# EAGLE design attiny2312 (EAGLE 6.4)
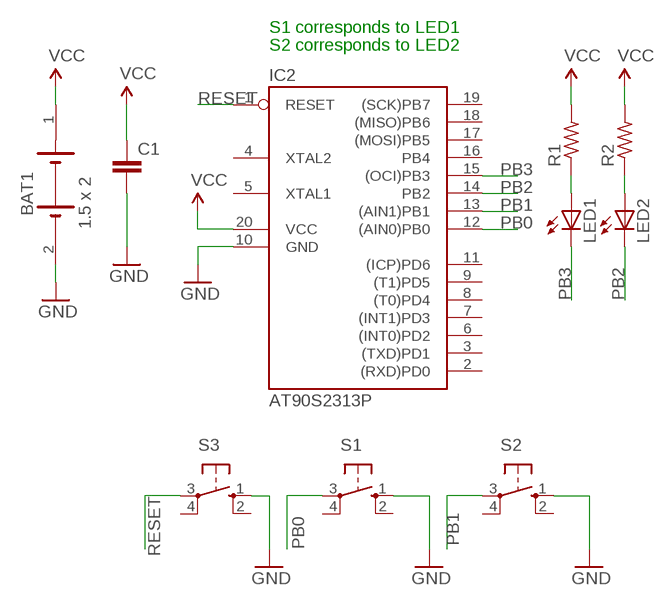
[diagram p0: schematic, sheet 1]

## Parts
BAT1  1.5 x 2  1.5X2BATTERYRELIMATE  [RELIMATE]
C1  C2.5/2  [C2.5-2]
IC2  AT90S2313P  [DIL20]
LED1  LED3MM  [LED3MM]
LED2  LED3MM  [LED3MM]
R1  R-US_0207/10  [0207/10]
R2  R-US_0207/10  [0207/10]
S1  10-XX  [B3F-10XX]
S2  10-XX  [B3F-10XX]
S3  10-XX  [B3F-10XX]

## Nets
GND: BAT1.2 C1.2 IC2.10(GND) S1.1(S) S2.1(S) S3.1(S)
N$3: LED1.A R1.1
N$4: LED2.A R2.1
PB0: IC2.12((AIN0)PB0) S1.3(P)
PB1: IC2.13((AIN1)PB1) S2.3(P)
PB2: IC2.14(PB2) LED2.K(C)
PB3: IC2.15((OCI)PB3) LED1.K(C)
RESET: IC2.1(RESET) S3.3(P)
VCC: BAT1.1 C1.1 IC2.20(VCC) R1.2 R2.2
Unconnected: IC2.2((RXD)PD0) IC2.3((TXD)PD1) IC2.4(XTAL2) IC2.5(XTAL1) IC2.6((INT0)PD2) IC2.7((INT1)PD3) IC2.8((T0)PD4) IC2.9((T1)PD5) IC2.11((ICP)PD6) IC2.16(PB4) IC2.17((MOSI)PB5) IC2.18((MISO)PB6) IC2.19((SCK)PB7) S1.2(S1) S1.4(P1) S2.2(S1) S2.4(P1) S3.2(S1) S3.4(P1)

## Notes on the sheet
- S1 corresponds to LED1
- S2 corresponds to LED2

## Library data of the parts
BAT1 = nehul:1.5X2BATTERY
C1 = capacitor-wima:C: CAPACITOR naming: grid - package width
IC2 = atmel:AT90S2313: MICROCONTROLLER 2 Kbytes FLASH 128 bytes SRAM 128 bytes EEPROM UART; OC_FARNELL: unknown; OC_NEWARK: unknown
LED1 LED2 = SparkFun:LED: LEDs Standard schematic elements and footprints for 5mm, 3mm, 1206, and 0603 sized LEDs. 5mm - Spark Fun Electronics SKU : COM-00529 (and others)
R1 R2 = rcl:R-US_: RESISTOR, American symbol
S1-S3 = switch-omron:10-XX: OMRON SWITCH

## Board
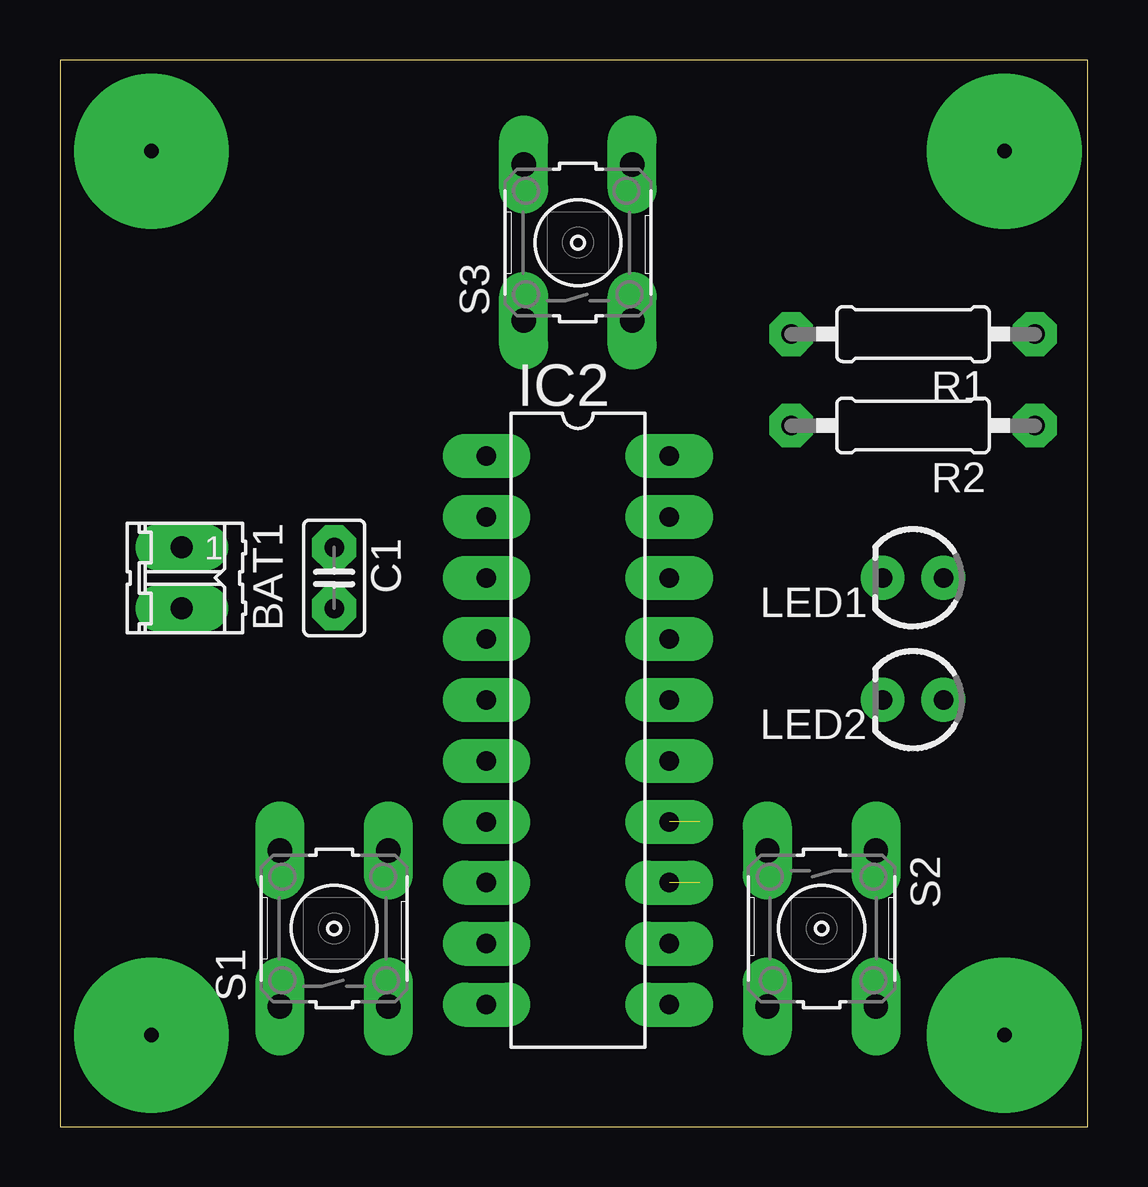
[diagram p1: board, top side]
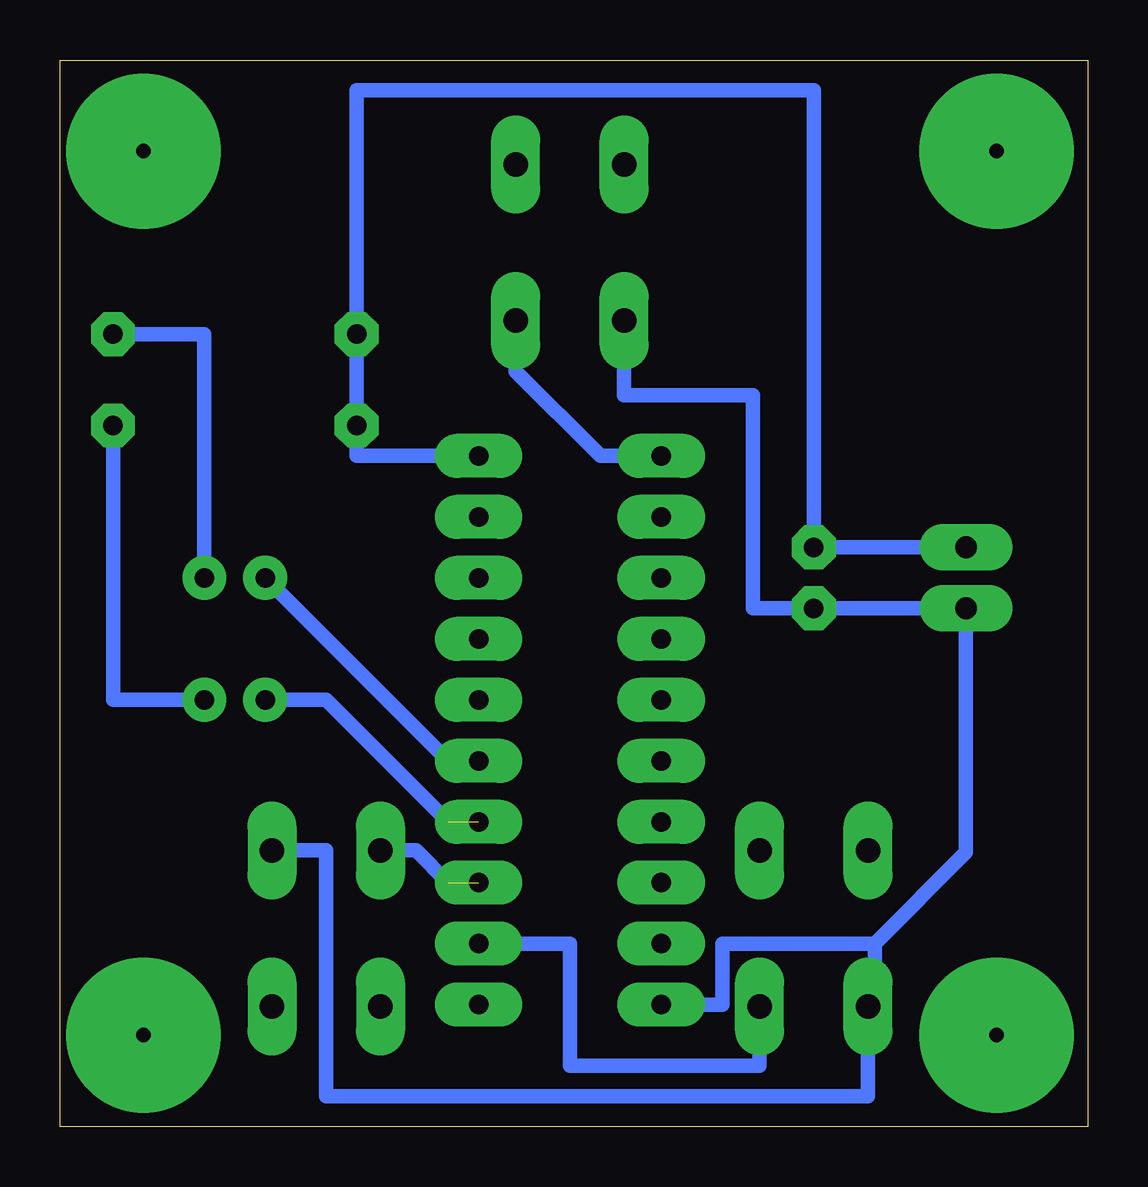
[diagram p2: board, bottom side, seen from below]

Size 42.85 x 44.44 mm. Coordinates in mm from the lower left corner, seen from the top.
Outline: 0,0 42.85,0 42.85,44.44 0,44.44 0,0
Copper layers (1*16): Top 0.035mm / dielectric 1.5mm / Bottom 0.035mm
Design rules "default *": minimum track width 24mil, minimum drill 24mil, track to track 20mil, track to pad 20mil, pad to pad 20mil, via to via 20mil, smd to smd 20mil, copper to edge 40mil, drill to drill 8mil, minimum pad ring 20mil, minimum via ring 20mil, stop-mask expansion 4mil, vias tented up to drill 0mil, thermal gap 10mil

### Footprints (pad centres in the part's own frame; a part is rotated, then mirrored left to right if it is on the bottom)
RELIMATE = drill 0.914 long: 1 1.27,2.54; 2 3.81,2.54
C2.5-2 = drill 0.813 pad 1.6 octagon: 1 -1.27,0; 2 1.27,0
DIL20 = drill 0.813 long: 1 -11.43,-3.81; 2 -8.89,-3.81; 3 -6.35,-3.81; 4 -3.81,-3.81; 5 -1.27,-3.81; 6 1.27,-3.81; 7 3.81,-3.81; 8 6.35,-3.81; 9 8.89,-3.81; 10 11.43,-3.81; 11 11.43,3.81; 12 8.89,3.81; 13 6.35,3.81; 14 3.81,3.81; 15 1.27,3.81; 16 -1.27,3.81; 17 -3.81,3.81; 18 -6.35,3.81; 19 -8.89,3.81; 20 -11.43,3.81
LED3MM = drill 0.813: A -1.27,0; K 1.27,0
0207/10 = drill 0.813 octagon: 1 -5.08,0; 2 5.08,0
B3F-10XX = drill 1.016 long: 1 -3.251,2.261; 2 3.251,2.261; 3 -3.251,-2.261; 4 3.251,-2.261

### Placement (x,y rotation side)
BAT1  2.54,25.4 270 top
C1  11.43,22.86 270 top
IC2  21.59,16.51 270 top
LED1  35.56,22.86 180 top
LED2  35.56,17.78 180 top
R1  35.56,33.02 180 top
R2  35.56,29.21 180 top
S1  11.43,8.26 90 top
S2  31.75,8.26 270 top
S3  21.59,36.83 90 top

### Tracks (layer width: path | path; a pad name or v marks a point on that pad's centre or on a via)
GND
  Bottom 0.61: 8.89,7.62 5.08,11.43 BAT1.2 C1.2 13.97,21.59 13.97,30.48 19.33,30.48 S3.1 | 8.89,7.62 15.24,7.62 15.24,5.08 IC2.10 | S2.1 31.75,11.51 31.75,1.27 9.17,1.27 S1.1 8.89,5.28 8.89,7.62
N$1  (via drill 0.6 pad 6.45)
  other vias: 3.81,3.81
N$2  (via drill 0.6 pad 6.45)
  other vias: 39.37,3.81
N$3
  Bottom 0.61: R1.1 36.83,33.02 LED1.A
N$4
  Bottom 0.61: R2.1 40.64,17.78 LED2.A
N$5  (via drill 0.6 pad 6.45)
  other vias: 39.37,40.64
N$6  (via drill 0.6 pad 6.45)
  other vias: 3.81,40.64
PB0
  Bottom 0.61: IC2.12 21.59,7.62 21.59,2.54 13.69,2.54 S1.3
PB1  (1 unrouted)
  Bottom 0.61: 26.67,10.16 28.02,11.51 S2.3
PB2  (1 unrouted)
  Bottom 0.61: 26.67,12.7 31.75,17.78 LED2.K
PB3
  Bottom 0.61: IC2.15 26.67,15.24 LED1.K
RESET
  Bottom 0.61: S3.3 23.85,31.47 20.32,27.94 IC2.1
VCC
  Bottom 0.61: IC2.20 30.48,27.94 R2.2 R1.2 30.48,43.18 11.43,43.18 C1.1 BAT1.1